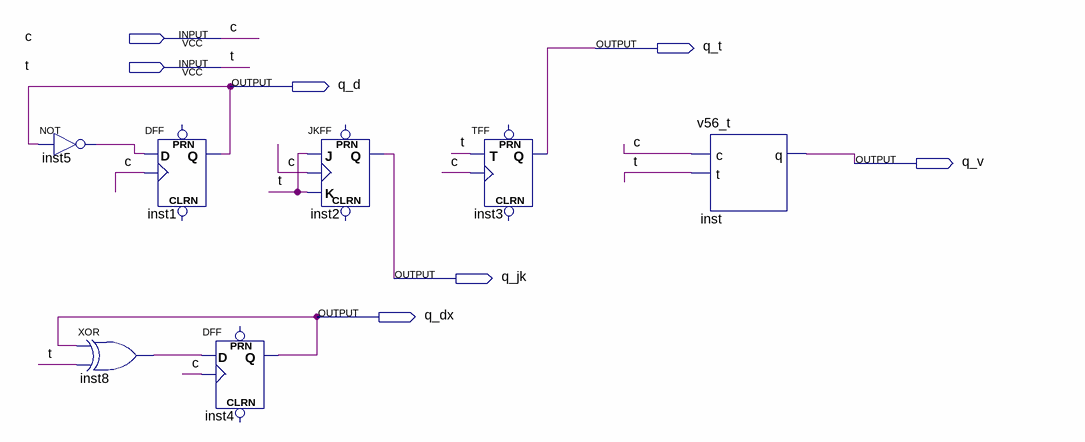
[diagram p0: schematic sheet]
// Quartus schematic sv56.bdf as structural Verilog: 7 symbols, 7 pins
module sv56 (
  input  c,
  input  t,
  output q_t,
  output q_d,
  output q_v,
  output q_jk,
  output q_dx
);

  wire inst5_out, inst8_out;

  not inst5 (inst5_out, q_d);
  xor inst8 (inst8_out, q_dx, t);
  DFF inst1 (.CLK(c), .D(inst5_out), .Q(q_d));  // open: CLRN, PRN
  DFF inst4 (.CLK(c), .D(inst8_out), .Q(q_dx));  // open: CLRN, PRN
  JKFF inst2 (.K(t), .J(t), .CLK(c), .Q(q_jk));  // open: PRN, CLRN
  TFF inst3 (.T(t), .CLK(c), .Q(q_t));  // open: PRN, CLRN
  v56_t inst (.c(c), .t(t), .q(q_v));
endmodule
